# Altium schematic sheet Connector B.SchDoc
size A4; SheetNumber: 2; SheetTotal: 9
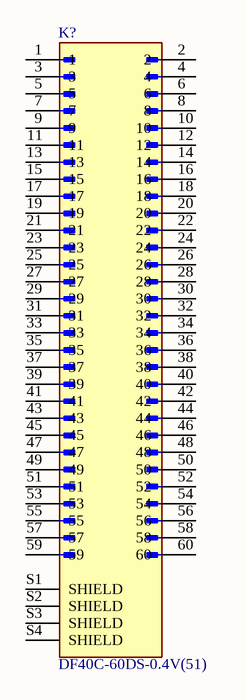
[diagram p0: Connector B.SchDoc]

## Parts
K?  DF40C-60DS-0.4V(51)  [DF40C-60DS-0.4V(51)]

## Nets

Not connected (* = marked no-connect by the designer): K? 1 2 3 4 5 6 7 8 9 10 11 12 13 14 15 16 17 18 19 20 21 22 23 24 25 26 27 28 29 30 31 32 33 34 35 36 37 38 39 40 41 42 43 44 45 46 47 48 49 50 51 52 53 54 55 56 57 58 59 60 S1(SHIELD) S2(SHIELD) S3(SHIELD) S4(SHIELD)

## Library data of the parts
K? = DF40C-60DS-0.4V(51): 60 Position Connector Receptacle, Center Strip Contacts Surface Mount Gold /